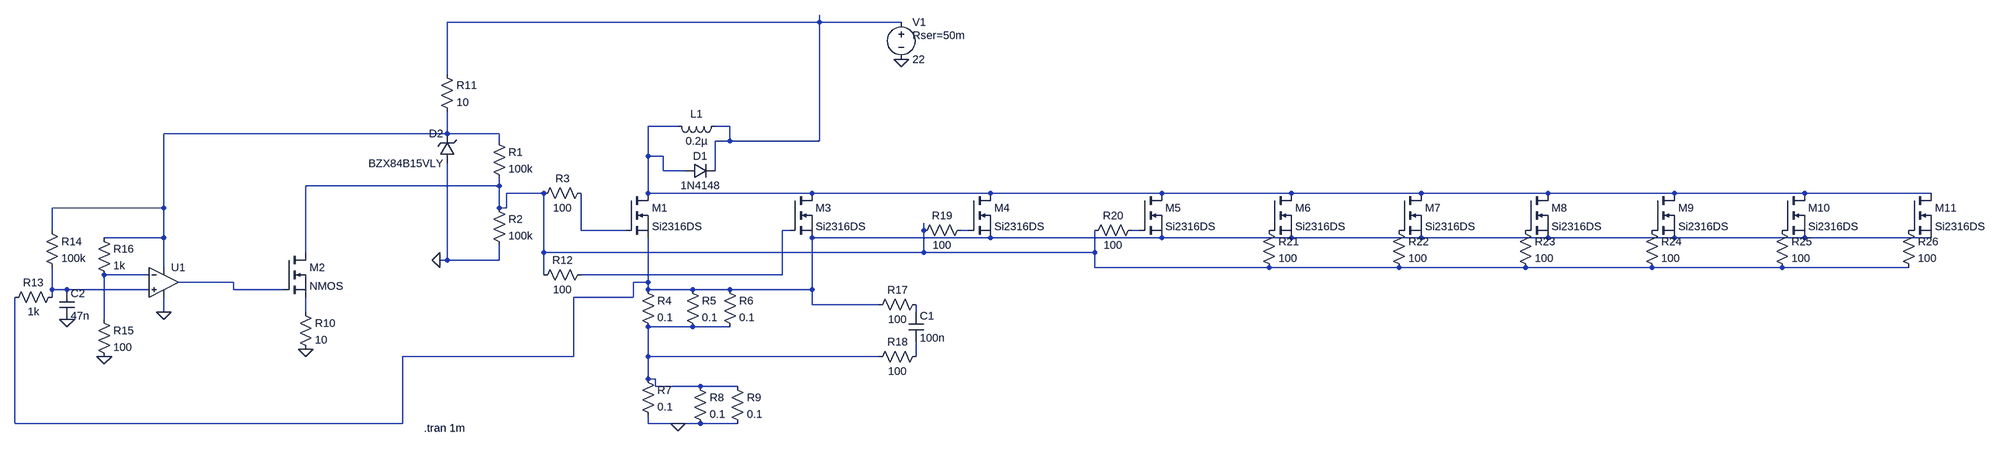
[diagram p0: schematic Draft2.asc]
Draft2.asc, the LTspice schematic file:
Version 4
SHEET 1 3788 680
WIRE 928 -224 928 -240
WIRE 928 -224 128 -224
WIRE 1104 -224 928 -224
WIRE 128 -112 128 -224
WIRE 624 0 560 0
WIRE 736 0 704 0
WIRE 128 16 128 -32
WIRE 128 16 -656 16
WIRE 240 16 128 16
WIRE 240 32 240 16
WIRE 736 32 736 0
WIRE 736 32 704 32
WIRE 928 32 928 -224
WIRE 928 32 736 32
WIRE 560 64 560 0
WIRE 592 64 560 64
WIRE 592 96 592 64
WIRE 640 96 592 96
WIRE 704 96 704 32
WIRE 240 128 240 112
WIRE 240 128 -176 128
WIRE 336 144 256 144
WIRE 560 144 560 64
WIRE 912 144 560 144
WIRE 1296 144 912 144
WIRE 1712 144 1296 144
WIRE 2096 144 1712 144
WIRE 2560 144 2096 144
WIRE 2832 144 2560 144
WIRE 3104 144 2832 144
WIRE 3392 144 3104 144
WIRE 3664 144 3392 144
WIRE -656 176 -656 16
WIRE -656 176 -896 176
WIRE 240 176 240 128
WIRE 256 176 256 144
WIRE 256 176 240 176
WIRE -896 224 -896 176
WIRE 416 224 416 144
WIRE 512 224 416 224
WIRE 864 224 848 224
WIRE 1152 224 1152 208
WIRE 1248 224 1232 224
WIRE 1664 224 1648 224
WIRE -656 240 -656 176
WIRE -656 240 -784 240
WIRE 1296 240 912 240
WIRE 1712 240 1296 240
WIRE 2096 240 1712 240
WIRE 2560 240 2096 240
WIRE 2832 240 2560 240
WIRE 3104 240 2832 240
WIRE 3392 240 3104 240
WIRE 3664 240 3392 240
WIRE -176 272 -176 128
WIRE 336 272 336 144
WIRE 1152 272 1152 224
WIRE 1152 272 336 272
WIRE 1568 272 1568 224
WIRE 1568 272 1152 272
WIRE 128 288 128 80
WIRE 128 288 112 288
WIRE 240 288 240 256
WIRE 240 288 128 288
WIRE -656 304 -656 240
WIRE 1568 304 1568 272
WIRE 2048 304 1568 304
WIRE 2512 304 2048 304
WIRE 2784 304 2512 304
WIRE 3056 304 2784 304
WIRE 3344 304 3056 304
WIRE 3616 304 3344 304
WIRE -688 320 -784 320
WIRE 336 320 336 272
WIRE 848 320 848 224
WIRE 848 320 416 320
WIRE -384 336 -624 336
WIRE 560 336 560 240
WIRE 560 336 528 336
WIRE -896 352 -896 304
WIRE -864 352 -896 352
WIRE -688 352 -864 352
WIRE -384 352 -384 336
WIRE -224 352 -384 352
WIRE 560 352 560 336
WIRE 656 352 560 352
WIRE 736 352 656 352
WIRE 912 352 912 240
WIRE 912 352 736 352
WIRE -896 368 -896 352
WIRE 528 368 528 336
WIRE 528 368 400 368
WIRE 912 384 912 352
WIRE 1056 384 912 384
WIRE -656 400 -656 368
WIRE -176 400 -176 368
WIRE 1136 400 1136 384
WIRE -784 416 -784 320
WIRE 656 432 560 432
WIRE 736 432 656 432
WIRE 400 496 400 368
WIRE 400 496 32 496
WIRE 560 496 560 432
WIRE 1056 496 560 496
WIRE 1136 496 1136 464
WIRE 560 544 560 496
WIRE 576 544 560 544
WIRE 576 560 576 544
WIRE 672 560 576 560
WIRE 752 560 672 560
WIRE -976 640 -976 368
WIRE 32 640 32 496
WIRE 32 640 -976 640
WIRE 560 640 560 624
WIRE 624 640 560 640
WIRE 672 640 624 640
WIRE 752 640 672 640
FLAG 112 288 0
FLAG -176 480 0
FLAG -656 400 0
FLAG -784 496 0
FLAG 1104 -144 0
FLAG -864 416 0
FLAG 624 640 0
SYMBOL res 224 16 R0
SYMATTR InstName R1
SYMATTR Value 100k
SYMBOL res 224 160 R0
SYMATTR InstName R2
SYMATTR Value 100k
SYMBOL res 432 128 R90
WINDOW 0 0 56 VBottom 2
WINDOW 3 32 56 VTop 2
SYMATTR InstName R3
SYMATTR Value 100
SYMBOL nmos 512 144 R0
SYMATTR InstName M1
SYMATTR Value Si2316DS
SYMBOL res 544 336 R0
SYMATTR InstName R4
SYMATTR Value 0.1
SYMBOL res 640 336 R0
SYMATTR InstName R5
SYMATTR Value 0.1
SYMBOL res 720 336 R0
SYMATTR InstName R6
SYMATTR Value 0.1
SYMBOL res 544 528 R0
SYMATTR InstName R7
SYMATTR Value 0.1
SYMBOL res 656 544 R0
SYMATTR InstName R8
SYMATTR Value 0.1
SYMBOL res 736 544 R0
SYMATTR InstName R9
SYMATTR Value 0.1
SYMBOL ind 720 -16 R90
WINDOW 0 5 56 VBottom 2
WINDOW 3 32 56 VTop 2
SYMATTR InstName L1
SYMATTR Value 0.2µ
SYMATTR SpiceLine Rser=10m
SYMBOL diode 640 112 R270
WINDOW 0 32 32 VTop 2
WINDOW 3 0 32 VBottom 2
SYMATTR InstName D1
SYMATTR Value 1N4148
SYMBOL nmos -224 272 R0
SYMATTR InstName M2
SYMBOL res -192 384 R0
SYMATTR InstName R10
SYMATTR Value 10
SYMBOL zener 144 80 R180
WINDOW 0 24 64 Left 2
WINDOW 3 24 0 Left 2
SYMATTR InstName D2
SYMATTR Value BZX84B15VLY
SYMBOL res 112 -128 R0
SYMATTR InstName R11
SYMATTR Value 10
SYMBOL nmos 864 144 R0
SYMATTR InstName M3
SYMATTR Value Si2316DS
SYMBOL res 432 304 R90
WINDOW 0 0 56 VBottom 2
WINDOW 3 32 56 VTop 2
SYMATTR InstName R12
SYMATTR Value 100
SYMBOL res -880 352 R90
WINDOW 0 0 56 VBottom 2
WINDOW 3 32 56 VTop 2
SYMATTR InstName R13
SYMATTR Value 1k
SYMBOL res -912 208 R0
SYMATTR InstName R14
SYMATTR Value 100k
SYMBOL res -800 400 R0
SYMATTR InstName R15
SYMATTR Value 100
SYMBOL res -800 224 R0
SYMATTR InstName R16
SYMATTR Value 1k
SYMBOL res 1152 368 R90
WINDOW 0 0 56 VBottom 2
WINDOW 3 32 56 VTop 2
SYMATTR InstName R17
SYMATTR Value 100
SYMBOL res 1152 480 R90
WINDOW 0 0 56 VBottom 2
WINDOW 3 32 56 VTop 2
SYMATTR InstName R18
SYMATTR Value 100
SYMBOL cap 1120 400 R0
SYMATTR InstName C1
SYMATTR Value 100n
SYMBOL voltage 1104 -240 R0
WINDOW 123 0 0 Left 0
WINDOW 39 24 44 Left 2
SYMATTR InstName V1
SYMATTR Value 22
SYMATTR SpiceLine Rser=50m
SYMBOL nmos 1248 144 R0
SYMATTR InstName M4
SYMATTR Value Si2316DS
SYMBOL nmos 1664 144 R0
SYMATTR InstName M5
SYMATTR Value Si2316DS
SYMBOL res 1248 208 R90
WINDOW 0 0 56 VBottom 2
WINDOW 3 32 56 VTop 2
SYMATTR InstName R19
SYMATTR Value 100
SYMBOL res 1664 208 R90
WINDOW 0 0 56 VBottom 2
WINDOW 3 32 56 VTop 2
SYMATTR InstName R20
SYMATTR Value 100
SYMBOL nmos 2048 144 R0
SYMATTR InstName M6
SYMATTR Value Si2316DS
SYMBOL nmos 2512 144 R0
SYMATTR InstName M7
SYMATTR Value Si2316DS
SYMBOL res 2032 208 R0
SYMATTR InstName R21
SYMATTR Value 100
SYMBOL res 2496 208 R0
SYMATTR InstName R22
SYMATTR Value 100
SYMBOL nmos 2784 144 R0
SYMATTR InstName M8
SYMATTR Value Si2316DS
SYMBOL res 2768 208 R0
SYMATTR InstName R23
SYMATTR Value 100
SYMBOL nmos 3056 144 R0
SYMATTR InstName M9
SYMATTR Value Si2316DS
SYMBOL res 3040 208 R0
SYMATTR InstName R24
SYMATTR Value 100
SYMBOL nmos 3344 144 R0
SYMATTR InstName M10
SYMATTR Value Si2316DS
SYMBOL res 3328 208 R0
SYMATTR InstName R25
SYMATTR Value 100
SYMBOL nmos 3616 144 R0
SYMATTR InstName M11
SYMATTR Value Si2316DS
SYMBOL res 3600 208 R0
SYMATTR InstName R26
SYMATTR Value 100
SYMBOL cap -880 352 R0
SYMATTR InstName C2
SYMATTR Value 47n
SYMBOL OpAmps\\UniversalOpAmp2 -656 336 R0
SYMATTR InstName U1
TEXT 78 650 Left 2 !.tran 1m

The netlist it stands for:
* Draft2.asc
R1 N003 N004 100k
R2 N004 0 100k
R3 N005 N004 100
M1 N002 N005 N009 N009 Si2316DS
R4 N009 N015 0.1
R5 N009 N015 0.1
R6 N009 N015 0.1
R7 N015 0 0.1
R8 N015 0 0.1
R9 N015 0 0.1
L1 N001 N002 0.2µ Rser=10m
D1 N002 N001 1N4148
M2 N004 N011 N013 N013 NMOS
R10 N013 0 10
D2 0 N003 BZX84B15VLY
R11 N001 N003 10
M3 N002 N006 N009 N009 Si2316DS
R12 N006 N004 100
R13 N012 N009 1k
R14 N003 N012 100k
R15 N010 0 100
R16 N003 N010 1k
R17 N014 N009 100
R18 N016 N015 100
C1 N014 N016 100n
V1 N001 0 22 Rser=50m
M4 N002 N007 N009 N009 Si2316DS
M5 N002 N008 N009 N009 Si2316DS
R19 N007 N004 100
R20 N008 N004 100
M6 N002 P001 N009 N009 Si2316DS
M7 N002 P002 N009 N009 Si2316DS
R21 P001 N004 100
R22 P002 N004 100
M8 N002 P003 N009 N009 Si2316DS
R23 P003 N004 100
M9 N002 P004 N009 N009 Si2316DS
R24 P004 N004 100
M10 N002 P005 N009 N009 Si2316DS
R25 P005 N004 100
M11 N002 P006 N009 N009 Si2316DS
R26 P006 N004 100
C2 N012 0 47n
XU1 N012 N010 N003 0 N011 level2 Avol=1Meg GBW=10Meg Slew=10Meg Ilimit=25m Rail=0 Vos=0 En=0 Enk=0 In=0 Ink=0 Rin=500Meg  ; pins In+ In- V+ V- OUT
.model D D
.lib standard.dio
.model NMOS NMOS
.model PMOS PMOS
.lib standard.mos
.tran 1m
.lib UniversalOpAmp2.lib
.backanno
.end